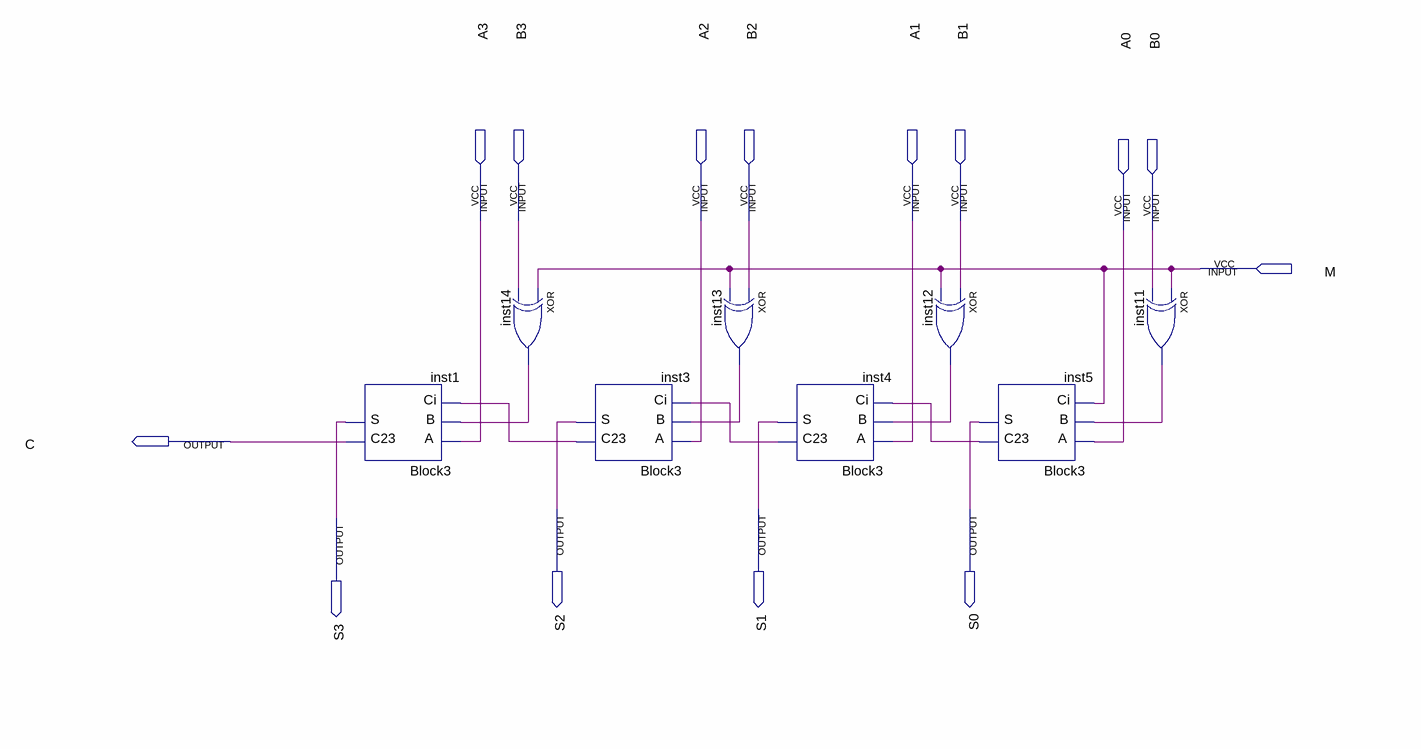
[diagram p0: schematic sheet]
// Quartus schematic Block5.bdf as structural Verilog: 8 symbols, 14 pins
module Block5 (
  input  A3,
  input  B3,
  input  A2,
  input  B2,
  input  A1,
  input  B1,
  input  A0,
  input  B0,
  input  M,
  output C,
  output S2,
  output S1,
  output S0,
  output S3
);

  wire inst3_c23, inst4_c23, inst5_c23, inst11_out, inst12_out, inst13_out, inst14_out;

  Block3 inst1 (.A(A3), .B(inst14_out), .Ci(inst3_c23), .C23(C), .S(S3));
  xor inst14 (inst14_out, M, B3);
  Block3 inst3 (.A(A2), .B(inst13_out), .Ci(inst4_c23), .C23(inst3_c23), .S(S2));
  xor inst13 (inst13_out, B2, M);
  Block3 inst4 (.A(A1), .B(inst12_out), .Ci(inst5_c23), .C23(inst4_c23), .S(S1));
  xor inst12 (inst12_out, B1, M);
  Block3 inst5 (.A(A0), .B(inst11_out), .Ci(M), .C23(inst5_c23), .S(S0));
  xor inst11 (inst11_out, M, B0);
endmodule
